# Altium schematic sheet Sheet4.SchDoc
size A3
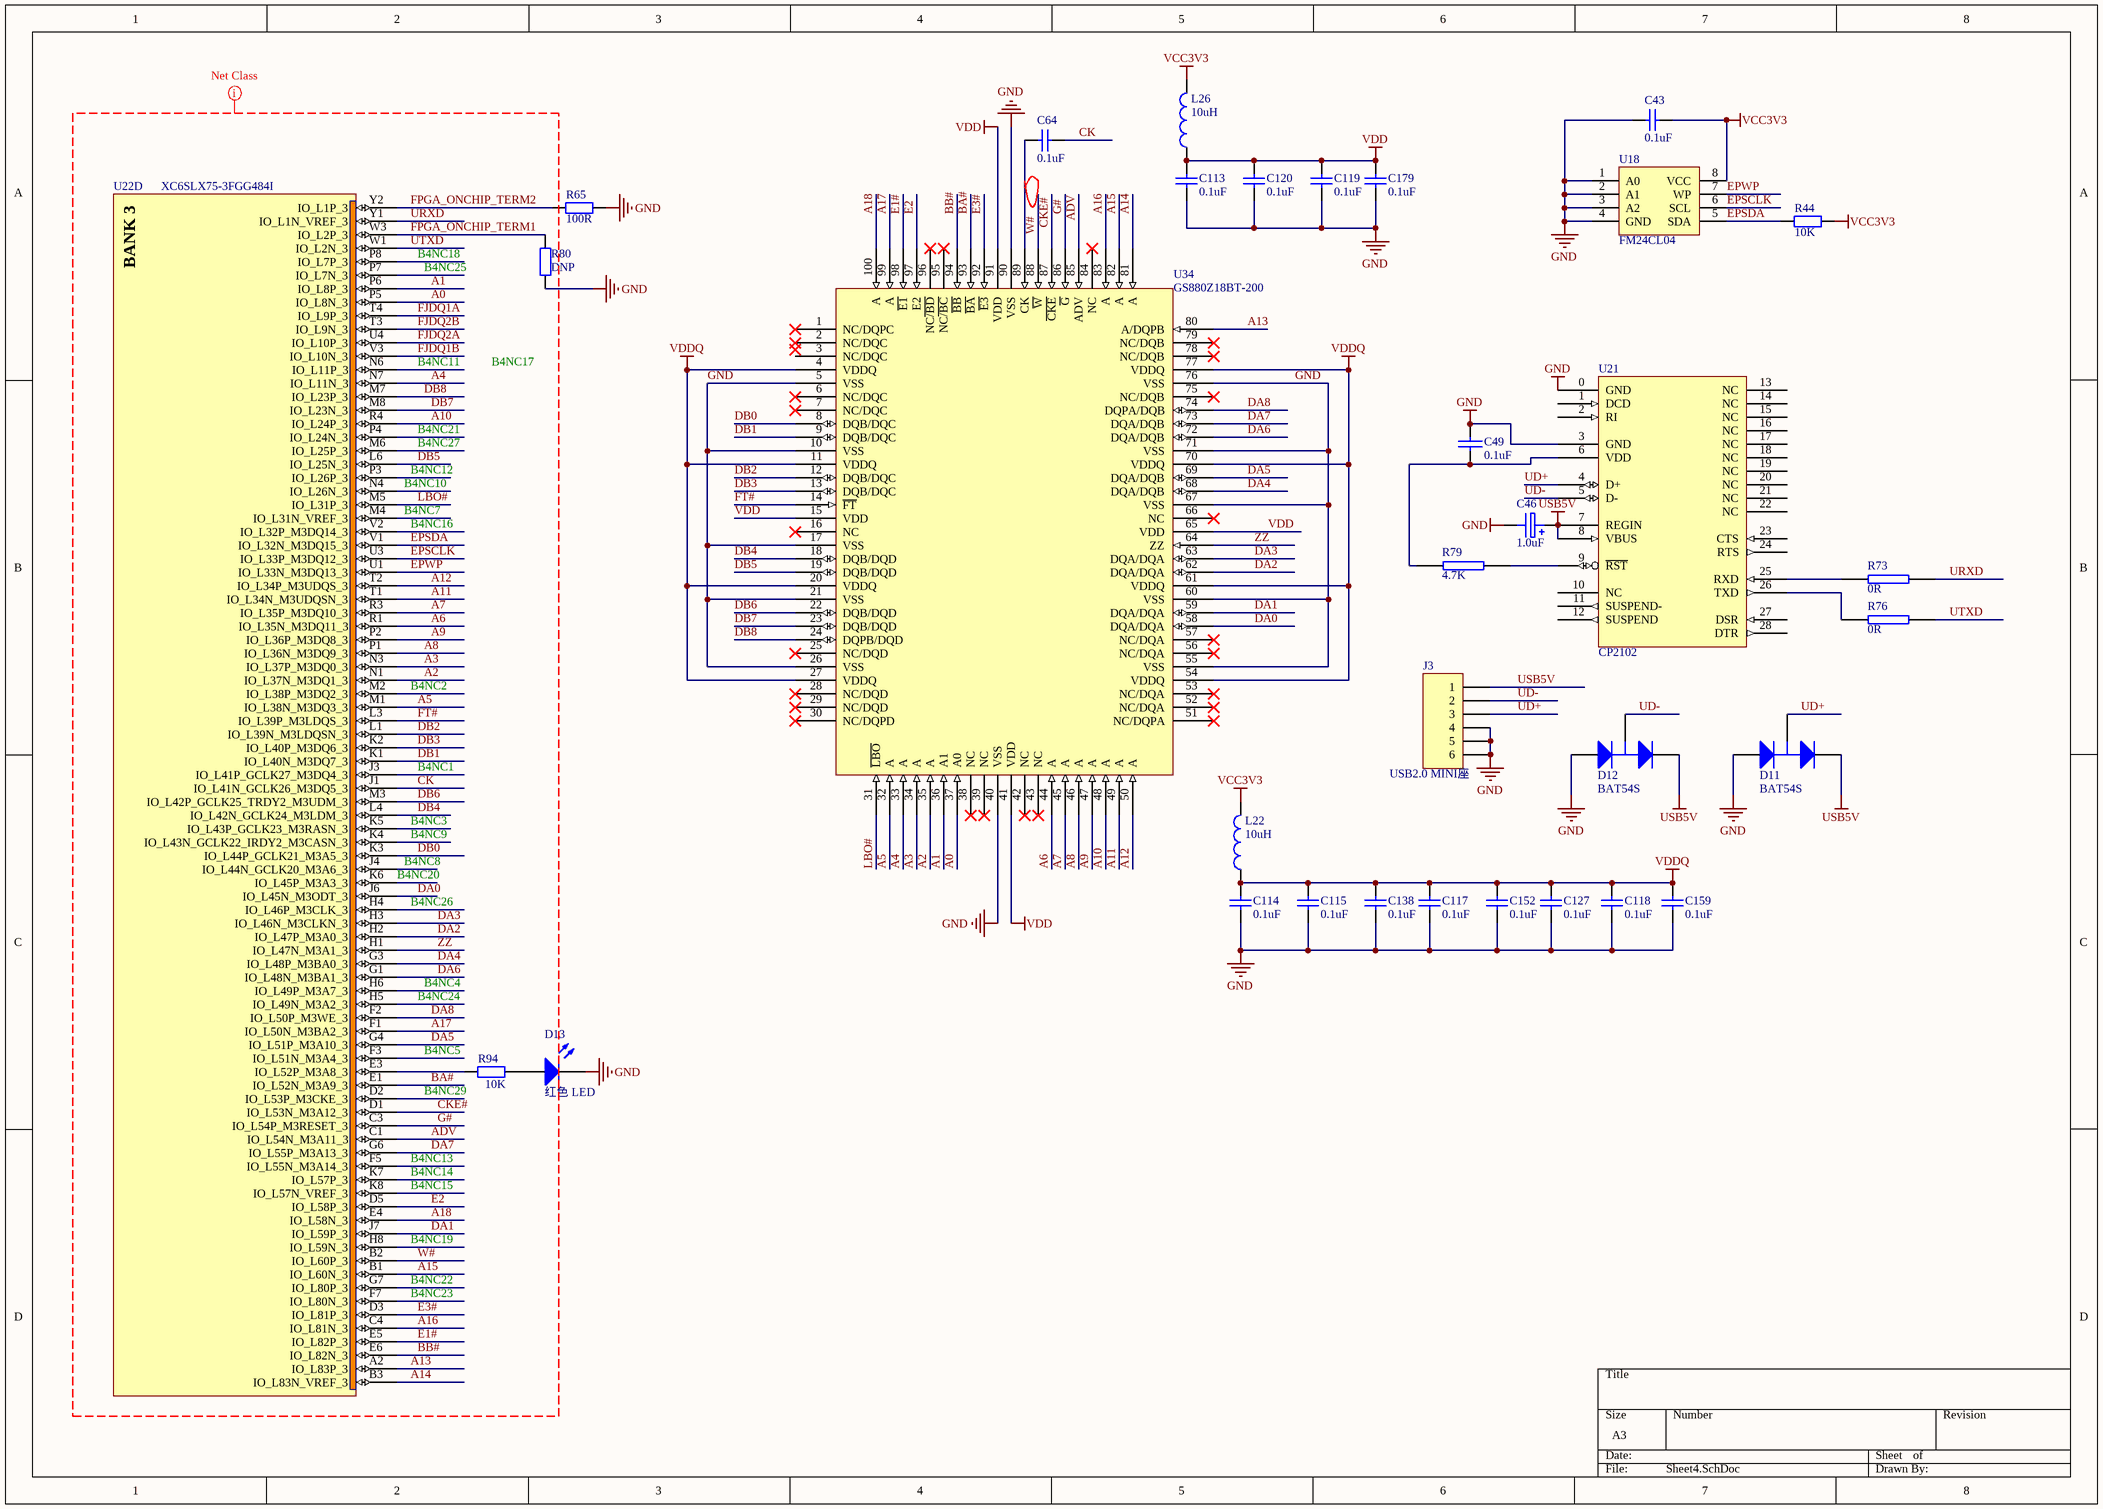
[diagram p0: Sheet4.SchDoc]

## Parts
C43  0.1uF  [0603C]
C46  1.0uF  [0805C]
C49  0.1uF  [0603C]
C64  0.1uF  [0402C]
C113  0.1uF  [0402C]
C114  0.1uF  [0402C]
C115  0.1uF  [0402C]
C117  0.1uF  [0402C]
C118  0.1uF  [0402C]
C119  0.1uF  [0402C]
C120  0.1uF  [0402C]
C127  0.1uF  [0402C]
C138  0.1uF  [0402C]
C152  0.1uF  [0402C]
C159  0.1uF  [0402C]
C179  0.1uF  [0402C]
D11  BAT54S  [SOT23-3L]
D12  BAT54S  [SOT23-3L]
D13  红色 LED  [0805LED]
J3  USB2.0 MINI座  [HDR1X4]
L22  10uH  [1206L]
L26  10uH  [1206L]
R44  10K  [0603R]
R65  100R  [0603R]
R73  0R  [0603R]
R76  0R  [0603R]
R79  4.7K  [0603R]
R80  DNP  [0603R]
R94  10K  [0603R]
U18  FM24CL04  [so_8]
U21  CP2102  [MLP-28]
U22  XC6SLX75-3FGG484I  [FGG484]  (part D of 8)
U34  GS880Z18BT-200  [QFP65P1680X2280-100N]

## Nets
GND: C43.2 C46.2 C49.2 C113.1 C114.1 C115.1 C117.1 C118.1 C119.1 C120.1 C127.1 C138.1 C152.1 C159.1 C179.1 D11.1(A) D12.1(A) D13.2(K) J3.4 J3.5 J3.6 R65.2 R80.2 U18.1(A0) U18.2(A1) U18.3(A2) U18.4(GND) U21.0(GND) U21.3(GND) U34.5(VSS) U34.10(VSS) U34.17(VSS) U34.21(VSS) U34.26(VSS) U34.40(VSS) U34.55(VSS) U34.60(VSS) U34.67(VSS) U34.71(VSS) U34.76(VSS) U34.90(VSS)
USB5V: C46.1 D11.2(K) D12.2(K) J3.1 U21.7(REGIN) U21.8(VBUS)
VCC3V3: C43.1 L22.2 L26.2 R44.2 U18.8(VCC)
VDD: C113.2 C119.2 C120.2 C179.2 L26.1 U34.15(VDD) U34.41(VDD) U34.65(VDD) U34.91(VDD)
VDDQ: C114.2 C115.2 C117.2 C118.2 C127.2 C138.2 C152.2 C159.2 L22.1 U34.4(VDDQ) U34.11(VDDQ) U34.20(VDDQ) U34.27(VDDQ) U34.54(VDDQ) U34.61(VDDQ) U34.70(VDDQ) U34.77(VDDQ)
A0: U22.P5(IO_L8N_3) U34.37(A0)
A1: U22.P6(IO_L8P_3) U34.36(A1)
A2: U22.N1(IO_L37N_M3DQ1_3) U34.35(A)
A3: U22.N3(IO_L37P_M3DQ0_3) U34.34(A)
A4: U22.N7(IO_L11N_3) U34.33(A)
A5: U22.M1(IO_L38N_M3DQ3_3) U34.32(A)
A6: U22.R1(IO_L35N_M3DQ11_3) U34.44(A)
A7: U22.R3(IO_L35P_M3DQ10_3) U34.45(A)
A8: U22.P1(IO_L36N_M3DQ9_3) U34.46(A)
A9: U22.P2(IO_L36P_M3DQ8_3) U34.47(A)
A10: U22.R4(IO_L24P_3) U34.48(A)
A11: U22.T1(IO_L34N_M3UDQSN_3) U34.49(A)
A12: U22.T2(IO_L34P_M3UDQS_3) U34.50(A)
A13: U22.A2(IO_L83P_3) U34.80(A/DQPB)
A14: U22.B3(IO_L83N_VREF_3) U34.81(A)
A15: U22.B1(IO_L60N_3) U34.82(A)
A16: U22.C4(IO_L81N_3) U34.83(A)
A17: U22.F1(IO_L50N_M3BA2_3) U34.99(A)
A18: U22.E4(IO_L58N_3) U34.100(A)
ADV: U22.C1(IO_L54N_M3A11_3) U34.85(ADV)
B4NC1: U22.J3(IO_L41P_GCLK27_M3DQ4_3)
B4NC2: U22.M2(IO_L38P_M3DQ2_3)
B4NC3: U22.K5(IO_L43P_GCLK23_M3RASN_3)
B4NC4: U22.H6(IO_L49P_M3A7_3)
B4NC5: U22.F3(IO_L51N_M3A4_3)
B4NC7: U22.M4(IO_L31N_VREF_3)
B4NC8: U22.J4(IO_L44N_GCLK20_M3A6_3)
B4NC9: U22.K4(IO_L43N_GCLK22_IRDY2_M3CASN_3)
B4NC10: U22.N4(IO_L26N_3)
B4NC11: U22.N6(IO_L11P_3)
B4NC12: U22.P3(IO_L26P_3)
B4NC13: U22.F5(IO_L55N_M3A14_3)
B4NC14: U22.K7(IO_L57P_3)
B4NC15: U22.K8(IO_L57N_VREF_3)
B4NC16: U22.V2(IO_L32P_M3DQ14_3)
B4NC18: U22.P8(IO_L7P_3)
B4NC19: U22.H8(IO_L59N_3)
B4NC20: U22.K6(IO_L45P_M3A3_3)
B4NC21: U22.P4(IO_L24N_3)
B4NC22: U22.G7(IO_L80P_3)
B4NC23: U22.F7(IO_L80N_3)
B4NC24: U22.H5(IO_L49N_M3A2_3)
B4NC25: U22.P7(IO_L7N_3)
B4NC26: U22.H4(IO_L46P_M3CLK_3)
B4NC27: U22.M6(IO_L25P_3)
B4NC29: U22.D2(IO_L53P_M3CKE_3)
BA#: U22.E1(IO_L52N_M3A9_3) U34.93(~{BA})
BB#: U22.E6(IO_L82N_3) U34.94(~{BB})
CK: C64.1 U22.J1(IO_L41N_GCLK26_M3DQ5_3)
CKE#: U22.D1(IO_L53N_M3A12_3) U34.87(~{CKE})
DA0: U22.J6(IO_L45N_M3ODT_3) U34.58(DQA/DQA)
DA1: U22.J7(IO_L59P_3) U34.59(DQA/DQA)
DA2: U22.H2(IO_L47P_M3A0_3) U34.62(DQA/DQA)
DA3: U22.H3(IO_L46N_M3CLKN_3) U34.63(DQA/DQA)
DA4: U22.G3(IO_L48P_M3BA0_3) U34.68(DQA/DQB)
DA5: U22.G4(IO_L51P_M3A10_3) U34.69(DQA/DQB)
DA6: U22.G1(IO_L48N_M3BA1_3) U34.72(DQA/DQB)
DA7: U22.G6(IO_L55P_M3A13_3) U34.73(DQA/DQB)
DA8: U22.F2(IO_L50P_M3WE_3) U34.74(DQPA/DQB)
DB0: U22.K3(IO_L44P_GCLK21_M3A5_3) U34.8(DQB/DQC)
DB1: U22.K1(IO_L40N_M3DQ7_3) U34.9(DQB/DQC)
DB2: U22.L1(IO_L39N_M3LDQSN_3) U34.12(DQB/DQC)
DB3: U22.K2(IO_L40P_M3DQ6_3) U34.13(DQB/DQC)
DB4: U22.L4(IO_L42N_GCLK24_M3LDM_3) U34.18(DQB/DQD)
DB5: U22.L6(IO_L25N_3) U34.19(DQB/DQD)
DB6: U22.M3(IO_L42P_GCLK25_TRDY2_M3UDM_3) U34.22(DQB/DQD)
DB7: U22.M8(IO_L23N_3) U34.23(DQB/DQD)
DB8: U22.M7(IO_L23P_3) U34.24(DQPB/DQD)
E1#: U22.E5(IO_L82P_3) U34.98(~{E1})
E2: U22.D5(IO_L58P_3) U34.97(E2)
E3#: U22.D3(IO_L81P_3) U34.92(~{E3})
EPSCLK: U18.6(SCL) U22.U3(IO_L33P_M3DQ12_3)
EPSDA: R44.1 U18.5(SDA) U22.V1(IO_L32N_M3DQ15_3)
EPWP: U18.7(WP) U22.U1(IO_L33N_M3DQ13_3)
FJDQ1A: U22.T4(IO_L9P_3)
FJDQ1B: U22.V3(IO_L10N_3)
FJDQ2A: U22.U4(IO_L10P_3)
FJDQ2B: U22.T3(IO_L9N_3)
FPGA_ONCHIP_TERM1: R80.1 U22.W3(IO_L2P_3)
FPGA_ONCHIP_TERM2: R65.1 U22.Y2(IO_L1P_3)
FT#: U22.L3(IO_L39P_M3LDQS_3) U34.14(~{FT})
G#: U22.C3(IO_L54P_M3RESET_3) U34.86(~{G})
LBO#: U22.M5(IO_L31P_3) U34.31(~{LBO})
UD+: D11.3(C) J3.3 U21.4(D+)
UD-: D12.3(C) J3.2 U21.5(D-)
URXD: R73.1 U22.Y1(IO_L1N_VREF_3)
UTXD: R76.1 U22.W1(IO_L2N_3)
W#: U22.B2(IO_L60P_3) U34.88(~{W})
ZZ: U22.H1(IO_L47N_M3A1_3) U34.64(ZZ)
NetC49_1: C49.1 R79.2 U21.6(VDD)
NetC64_2: C64.2 U34.89(CK)
NetD13_1: D13.1(A) R94.2
NetR73_2: R73.2 U21.25(RXD)
NetR76_2: R76.2 U21.26(TXD)
NetR79_1: R79.1 U21.9(~{RST})
NetR94_1: R94.1 U22.E3(IO_L52P_M3A8_3)

Not connected (* = marked no-connect by the designer): U21 1(DCD) 2(RI) 10(NC) 11(SUSPEND-) 12(SUSPEND) 13(NC) 14(NC) 15(NC) 16(NC) 17(NC) 18(NC) 19(NC) 20(NC) 21(NC) 22(NC) 23(CTS) 24(RTS) 27(DSR) 28(DTR); U34 1(NC/DQPC)* 2(NC/DQC)* 3(NC/DQC) 6(NC/DQC)* 7(NC/DQC)* 16(NC)* 25(NC/DQD)* 28(NC/DQD)* 29(NC/DQD)* 30(NC/DQPD)* 38(NC)* 39(NC)* 42(NC)* 43(NC)* 51(NC/DQPA)* 52(NC/DQA)* 53(NC/DQA)* 56(NC/DQA)* 57(NC/DQA)* 66(NC)* 75(NC/DQB)* 78(NC/DQB)* 79(NC/DQB)* 84(NC)* 95(NC~{/BC})* 96(NC~{/BD})*

## Layout directives
net class BNAK3: A0, A1, A2, A3, A4, A5, A6, A7, A8, A9, A10, A11, A12, A13, A14, A15, A16, A17, A18, ADV, B4NC1, B4NC2, B4NC3, B4NC4, B4NC5, B4NC7, B4NC8, B4NC9, B4NC10, B4NC11, B4NC12, B4NC13, B4NC14, B4NC15, B4NC16, B4NC17, B4NC18, B4NC19, B4NC20, B4NC21, B4NC22, B4NC23, B4NC24, B4NC25, B4NC26, B4NC27, B4NC29, BA#, BB#, CK, CKE#, DA0, DA1, DA2, DA3, DA4, DA5, DA6, DA7, DA8, DB0, DB1, DB2, DB3, DB4, DB5, DB6, DB7, DB8, E1#, E2, E3#, EPSCLK, EPSDA, EPWP, FJDQ1A, FJDQ1B, FJDQ2A, FJDQ2B, FPGA_ONCHIP_TERM1, FPGA_ONCHIP_TERM2, FT#, G#, LBO#, URXD, UTXD, W#, ZZ

## Notes on the sheet
- Labels drawn without touching a wire or pin: B4NC17
- (in symbol XC6SLX45-L1FGG484I, part D) BANK 3

## Library data of the parts
C43 C64 C113-C115 C117-C120 C127 C138 C152 C159 C179 = Cap: Capacitor; Published: 8-Jun-2000; LatestRevisionDate: 17-Jul-2002; LatestRevisionNote: Re-released for DXP Platform.; Publisher: Altium Limited; Value: 0.1uF
  C43 C64: PackageReference: RAD-0.3
  C113-C115 C117-C120 C127 C138 C152 C159 C179: PackageReference: 0805
C46 = ELECTRO1
C49 = CAP: Capacitor
D11 D12 = BAV99: Silicon Switching Diode Array for High-Speed Switching; Published: 21-Mar-2003; DatasheetDocument: Oct-1999; PackageDocument: Sep-2001; PackageReference: SOT-23; Publisher: Altium Limited; ComponentLink1Description: Manufacturer Link; ComponentLink1URL: http://www.infineon.com/; ComponentLink2Description: Datasheet; ComponentLink2URL: http://www.infineon.com/upload/Document/cmc_upload/documents/080/631/bav99series_1.pdf
D13 = LED0: Typical INFRARED GaAs LED; Published: 8-Jun-2000; LatestRevisionDate: 08-Jul-2005; LatestRevisionNote: Mech Layer 1 removed.; PackageReference: LED-0; Publisher: Altium Limited
J3 = Header 6: Header, 6-Pin; LatestRevisionDate: 17-Jul-2002; LatestRevisionNote: Re-released for DXP Platform.; Publisher: Altium Limited
L22 L26 = Inductor: Code_IEC: 1005; Published: 8-Jun-2000; LatestRevisionDate: 29-May-2009; LatestRevisionNote: IPC-7351 Footprint Added.; PackageReference: 0402-A; Publisher: Altium Limited; PackageDescription: Chip Inductor; Code_JEITA: 0402; Value: 10uH
R44 = Resistor
R65 R80 R94 = Res2: Resistor; Published: 8-Jun-2000; LatestRevisionDate: 17-Jul-2002; LatestRevisionNote: Re-released for DXP Platform.; PackageReference: AXIAL-0.4; Publisher: Altium Limited
  R65: Value: 100R
  R80: Value: DNP
  R94: Value: 10K
R73 R76 R79 = RES2
U21 = RF2906(28): 433MHZ PSK/FM/AM/Data Transceiver
U22 = XC6SLX45-L1FGG484I: Spartan-6 LX 1.0V FPGA, 316 User I/Os, 484-Ball Fine-Pitch BGA (1.0mm Pitch), Low Power Version, Industrial Grade, Pb-Free; FirstPublished: 17-Nov-2009; DatasheetVersion: ver1.3, Nov-2009; PackageVersion: ver1.1, Dec-2008; PackageReference: FGG484; Publisher: Altium Limited; PackageDescription: 484-Ball Fine Pitch Ball Grid Array 1.00 mm Pitch (FGG484) - Pb-Free; Code_JEDEC: MS-034-AAJ-1; Code_IPC: BGA100P22X22-484; ComponentLink1Description: Spartan-6 Datasheet; ComponentLink1URL: http://www.xilinx.com/support/documentation/data_sheets/ds160.pdf; ComponentLink2Description: Pinout Specification; ComponentLink2URL: http://www.xilinx.com/support/documentation/user_guides/ug385.pdf; ComponentLink3Description: FGG484 Package Drawing; ComponentLink3URL: http://www.xilinx.com/support/documentation/package_specs/fg484.pdf; ComponentLink4Description: Spartan-6 Documents; ComponentLink4URL: http://www.xilinx.com/support/documentation/spartan-6.htm; ComponentLink5Description: Xilinx.com Home; ComponentLink5URL: http://www.xilinx.com
U34 = GS880Z18BT100